# Altium schematic sheet USB_ULPI_USB3320.SchDoc
size A3; SheetNumber: 14; SheetTotal: 27
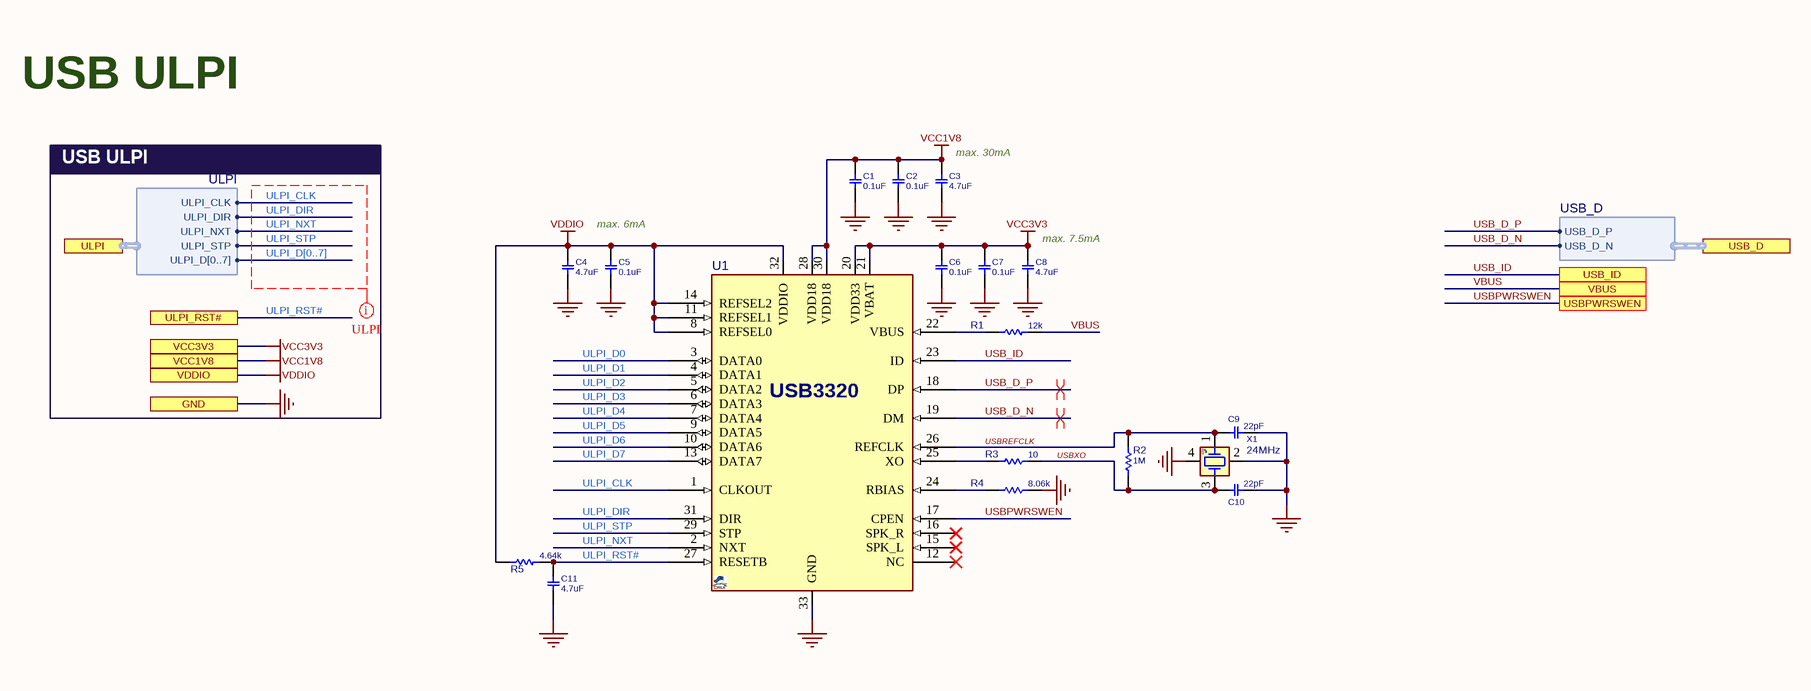
[diagram p0: USB_ULPI_USB3320.SchDoc]

## Parts
C1  0.1uF  [C0402]
C2  0.1uF  [C0402]
C3  4.7uF  [C0402]
C4  4.7uF  [C0402]
C5  0.1uF  [C0402]
C6  0.1uF  [C0402]
C7  0.1uF  [C0402]
C8  4.7uF  [C0402]
C9  22pF  [C0402]
C10  22pF  [C0402]
C11  4.7uF  [C0402]
R1  12k  [R0402]
R2  1M  [R0402]
R3  10  [R0402]
R4  8.06k  [R0402]
R5  4.64k  [R0402]
U1  USB3320  [QFN50_32T]  (value not drawn)
X1  24MHz  [XTL_4_2016]

## Ports
GND, ULPI (harness ULPI), ULPI_RST#, USB_D (harness USB_D), USB_ID, USBPWRSWEN, VBUS, VCC1V8, VCC3V3, VDDIO

## Harnesses
ULPI: ULPI_CLK, ULPI_DIR, ULPI_NXT, ULPI_STP, ULPI_D[0..7]
USB_D: USB_D_P, USB_D_N

## Nets
GND: C1.1 C2.1 C3.1 C4.1 C5.2 C6.1 C7.1 C8.1 C9.2 C10.2 C11.1 R4.2 U1.33(GND) X1.2 X1.4 ; port GND
VCC1V8: C1.2 C2.2 C3.2 U1.28(VDD18) U1.30(VDD18) ; port VCC1V8
VCC3V3: C6.2 C7.2 C8.2 U1.20(VDD33) U1.21(VBAT) ; port VCC3V3
VDDIO: C4.2 C5.1 R5.1 U1.8(REFSEL0) U1.11(REFSEL1) U1.14(REFSEL2) U1.32(VDDIO) ; port VDDIO
ULPI_CLK: U1.1(CLKOUT) ; port ULPI.ULPI_CLK
ULPI_D0: U1.3(DATA0)
ULPI_D1: U1.4(DATA1)
ULPI_D2: U1.5(DATA2)
ULPI_D3: U1.6(DATA3)
ULPI_D4: U1.7(DATA4)
ULPI_D5: U1.9(DATA5)
ULPI_D6: U1.10(DATA6)
ULPI_D7: U1.13(DATA7)
ULPI_DIR: U1.31(DIR) ; port ULPI.ULPI_DIR
ULPI_NXT: U1.2(NXT) ; port ULPI.ULPI_NXT
ULPI_RST#: C11.2 R5.2 U1.27(RESETB) ; port ULPI_RST#
ULPI_STP: U1.29(STP) ; port ULPI.ULPI_STP
USB_D_N: U1.19(DM) ; port USB_D.USB_D_N
USB_D_P: U1.18(DP) ; port USB_D.USB_D_P
USB_ID: U1.23(ID) ; port USB_ID
USBPWRSWEN: U1.17(CPEN) ; port USBPWRSWEN
USBREFCLK: C9.1 R2.2 U1.26(REFCLK) X1.1
USBXO: C10.1 R2.1 R3.1 X1.3
VBUS: R1.2 ; port VBUS
NetR1_1: R1.1 U1.22(VBUS)
NetR3_2: R3.2 U1.25(XO)
NetR4_1: R4.1 U1.24(RBIAS)

Not connected (* = marked no-connect by the designer): U1 12(NC)* 15(SPK_L)* 16(SPK_R)*

## Buses and harness runs
bus ULPI_D[0..7]

## Layout directives
net class ULPI: ULPI_CLK, ULPI_D[0..7], ULPI_DIR, ULPI_NXT, ULPI_STP
differential pair: USB_D_N, USB_D_P

## Notes on the sheet
- USB ULPI
- (near C3) max. 30mA
- max. 6mA
- (near C8) max. 7.5mA

## Library data of the parts
C1-C4 C6-C11 = CAP_SMD_MLCC_100n50TDK: CAP, MLCC; MANF: Murata; PARAM2: 50v; PARAM: -; MANF_P#: -; ASSEMBLY: ASSEMBLY; PRICE: 100: 0.018$
  C1 C2 C6 C7: VALUE: 0.1uF
  C3 C4 C8 C11: VALUE: 4.7uF
  C9 C10: VALUE: 22pF
C5 = CAP_SMD_MLCC_100n50TDK: CAP, MLCC; PARAM: X7R, 10%, -55~125oC; MANF_P#: GRM155R71H104KE14D; MANF: Murata; PARAM2: 50v; ASSEMBLY: ASSEMBLY; PRICE: 100: 0.018$; VALUE: 0.1uF
R1-R5 = RES_SMD: RESISTOR, SMD; PARAM: -W; DESC: DESCRIPTION; DIST#: MOUSER; PARAM2: 1%; MANF_P#: -; MANF: -; ASSEMBLY: ASSEMBLY; PRICE: 100= 0.5$
  R1: VALUE: 12k
  R2: VALUE: 1M
  R3: VALUE: 10
  R4: VALUE: 8.06k
  R5: VALUE: 4.64k
U1 = USB3320_QFN32: USB 2.0 ULPI Transceiver; MANF: SMSC; MANF_P#: USB3320C-EZK; VALUE: USB3320
X1 = XTL_4_24MHz_3225: Crystal 24MHz; MANF_P#: china; PARAM2: 10PPM, 18pF; PARAM: -20~75oC; MANF: -; PRICE: 0.5$; VALUE: 24MHz